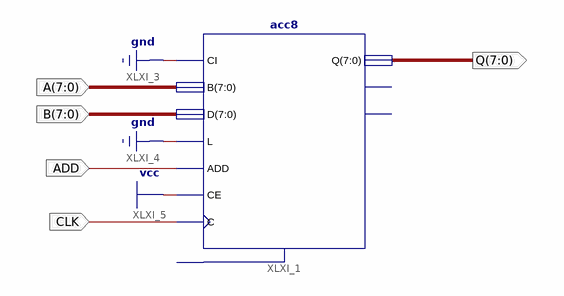
[diagram p0: schematic sheet 1]
// Xilinx ISE schematic ADD_SUB.sch (spartan6) as structural Verilog: 1 symbols, 5 ports
module ADD_SUB (
  input  [7:0] A,
  input  [7:0] B,
  input  ADD,
  input  CLK,
  output [7:0] Q
);

  acc8 XLXI_1 (.ADD(ADD), .B(A), .C(CLK), .CE(1'b1), .CI(1'b0), .D(B), .L(1'b0), .Q(Q));  // open: R, CO, OFL
endmodule
